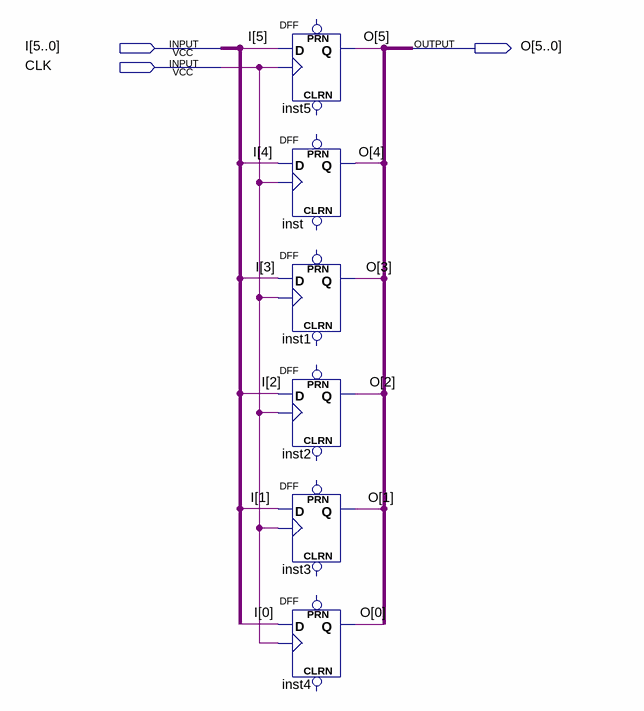
[diagram p0: schematic sheet]
// Quartus schematic register6.bdf as structural Verilog: 6 symbols, 3 pins
module register6 (
  input  [5:0] I,
  input  CLK,
  output [5:0] O
);

  DFF inst5 (.CLK(CLK), .D(I[5]), .Q(O[5]));  // open: CLRN, PRN
  DFF inst (.CLK(CLK), .D(I[4]), .Q(O[4]));  // open: CLRN, PRN
  DFF inst1 (.CLK(CLK), .D(I[3]), .Q(O[3]));  // open: CLRN, PRN
  DFF inst2 (.CLK(CLK), .D(I[2]), .Q(O[2]));  // open: CLRN, PRN
  DFF inst3 (.CLK(CLK), .D(I[1]), .Q(O[1]));  // open: CLRN, PRN
  DFF inst4 (.CLK(CLK), .D(I[0]), .Q(O[0]));  // open: CLRN, PRN
endmodule
